# Altium schematic sheet Connect.SchDoc
size A4
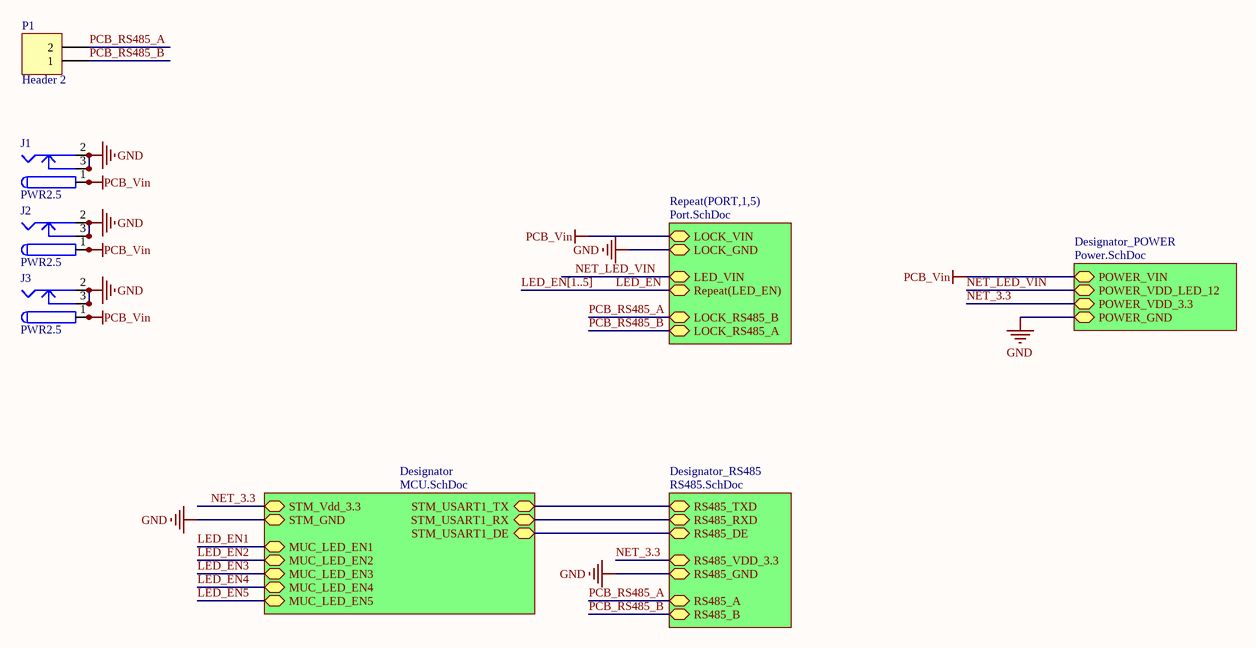
[diagram p0: Connect.SchDoc]

## Parts
J1  PWR2.5  [KLD-0202]
J2  PWR2.5  [KLD-0202]
J3  PWR2.5  [KLD-0202]
P1  Header 2  [KF128-2P]

## Sub-sheets
Designator = MCU.SchDoc: STM_USART1_RX, STM_USART1_DE, STM_Vdd_3.3, STM_USART1_TX, STM_GND, MUC_LED_EN3, MUC_LED_EN2, MUC_LED_EN5, MUC_LED_EN1, MUC_LED_EN4
Designator_POWER = Power.SchDoc: POWER_GND, POWER_VDD_LED_12, POWER_VIN, POWER_VDD_3.3
Designator_RS485 = RS485.SchDoc: RS485_RXD, RS485_TXD, RS485_DE, RS485_VDD_3.3, RS485_B, RS485_GND, RS485_A
Repeat(PORT,1,5) = Port.SchDoc: LOCK_GND, Repeat(LED_EN), LOCK_RS485_B, LOCK_RS485_A, LOCK_VIN, LED_VIN

## Nets
GND: J1.2 J1.2A J1.2B J1.3 J1.3A J1.3B J2.2 J2.2A J2.2B J2.3 J2.3A J2.3B J3.2 J3.2A J3.2B J3.3 J3.3A J3.3B ; sheet Repeat(PORT,1,5)/LOCK_GND, sheet Designator_POWER/POWER_GND, sheet Designator_RS485/RS485_GND, sheet Designator/STM_GND
PCB_Vin: J1.1 J1.1A J1.1B J2.1 J2.1A J2.1B J3.1 J3.1A J3.1B ; sheet Repeat(PORT,1,5)/LOCK_VIN, sheet Designator_POWER/POWER_VIN
LED_EN: sheet Repeat(PORT,1,5)/Repeat(LED_EN)
LED_EN1: sheet Designator/MUC_LED_EN1
LED_EN2: sheet Designator/MUC_LED_EN2
LED_EN3: sheet Designator/MUC_LED_EN3
LED_EN4: sheet Designator/MUC_LED_EN4
LED_EN5: sheet Designator/MUC_LED_EN5
NET_3.3: sheet Designator_POWER/POWER_VDD_3.3, sheet Designator_RS485/RS485_VDD_3.3, sheet Designator/STM_Vdd_3.3
NET_LED_VIN: sheet Repeat(PORT,1,5)/LED_VIN, sheet Designator_POWER/POWER_VDD_LED_12
PCB_RS485_A: P1.2 ; sheet Repeat(PORT,1,5)/LOCK_RS485_B, sheet Designator_RS485/RS485_A
PCB_RS485_B: P1.1 ; sheet Repeat(PORT,1,5)/LOCK_RS485_A, sheet Designator_RS485/RS485_B
(unnamed): sheet Designator_RS485/RS485_RXD, sheet Designator/STM_USART1_RX
(unnamed): sheet Designator_RS485/RS485_TXD, sheet Designator/STM_USART1_TX
(unnamed): sheet Designator_RS485/RS485_DE, sheet Designator/STM_USART1_DE

## Buses and harness runs
bus LED_EN[1..5]

## Library data of the parts
J1-J3 = PWR2.5: Low Voltage Power Supply Connector; Published: 17-Dec-2003; DatasheetDocument: 09-May-2002; Publisher: Altium Limited; ComponentLink1Description: Manufacturer Link; ComponentLink1URL: http://domino.kycon.com/internet/Products.html
P1 = Header 2: Header, 2-Pin; LatestRevisionDate: 17-Jul-2002; LatestRevisionNote: Re-released for DXP Platform.; Publisher: Altium Limited